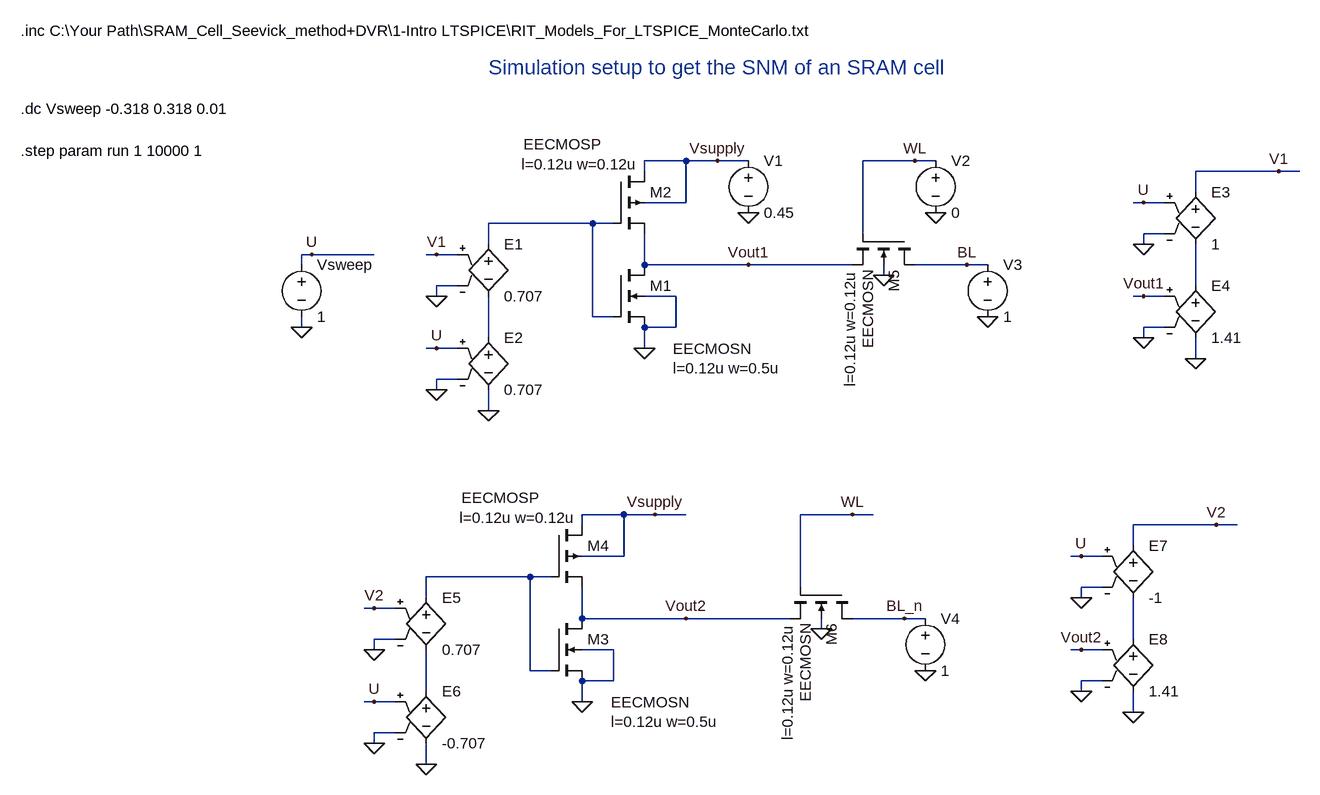
[diagram p0: schematic SNM.asc]
SNM.asc, the LTspice schematic file:
Version 4
SHEET 1 1508 980
WIRE 240 32 176 32
WIRE 288 32 240 32
WIRE 336 32 288 32
WIRE 592 32 512 32
WIRE 624 32 592 32
WIRE 176 48 176 32
WIRE 1152 48 1024 48
WIRE 1184 48 1152 48
WIRE 1024 80 1024 48
WIRE 240 96 240 32
WIRE 240 96 176 96
WIRE 944 96 928 96
WIRE 976 96 944 96
WIRE 96 128 -64 128
WIRE 128 128 96 128
WIRE 512 144 512 32
WIRE 976 144 944 144
WIRE -64 160 -64 128
WIRE 944 160 944 144
WIRE -336 176 -352 176
WIRE -240 176 -336 176
WIRE -144 176 -160 176
WIRE -112 176 -144 176
WIRE -352 192 -352 176
WIRE 176 192 176 144
WIRE 336 192 176 192
WIRE 496 192 336 192
WIRE 672 192 592 192
WIRE 704 192 672 192
WIRE 544 208 544 192
WIRE -112 224 -144 224
WIRE 1024 224 1024 160
WIRE -144 240 -144 224
WIRE 224 240 176 240
WIRE 944 240 928 240
WIRE 976 240 944 240
WIRE 96 272 96 128
WIRE 128 272 96 272
WIRE -352 288 -352 272
WIRE 224 288 224 240
WIRE 224 288 176 288
WIRE 976 288 944 288
WIRE -64 304 -64 240
WIRE 944 304 944 288
WIRE -144 320 -160 320
WIRE -112 320 -144 320
WIRE 176 320 176 288
WIRE 1024 336 1024 304
WIRE -112 368 -144 368
WIRE -144 384 -144 368
WIRE -64 416 -64 384
WIRE 144 576 80 576
WIRE 192 576 144 576
WIRE 240 576 192 576
WIRE 496 576 416 576
WIRE 528 576 496 576
WIRE 80 592 80 576
WIRE 1056 592 928 592
WIRE 1088 592 1056 592
WIRE 928 624 928 592
WIRE 144 640 144 576
WIRE 144 640 80 640
WIRE 848 640 832 640
WIRE 880 640 848 640
WIRE 0 672 -160 672
WIRE 32 672 0 672
WIRE 416 688 416 576
WIRE 880 688 848 688
WIRE -160 704 -160 672
WIRE 848 704 848 688
WIRE -240 720 -256 720
WIRE -208 720 -240 720
WIRE 80 736 80 688
WIRE 240 736 80 736
WIRE 400 736 240 736
WIRE 576 736 496 736
WIRE 608 736 576 736
WIRE 448 752 448 736
WIRE -208 768 -240 768
WIRE 928 768 928 704
WIRE -240 784 -240 768
WIRE 128 784 80 784
WIRE 848 784 832 784
WIRE 880 784 848 784
WIRE 0 816 0 672
WIRE 32 816 0 816
WIRE 128 832 128 784
WIRE 128 832 80 832
WIRE 880 832 848 832
WIRE -160 848 -160 784
WIRE 848 848 848 832
WIRE -240 864 -256 864
WIRE -208 864 -240 864
WIRE 80 864 80 832
WIRE 928 880 928 848
WIRE -208 912 -240 912
WIRE -240 928 -240 912
WIRE -160 960 -160 928
FLAG -352 288 0
FLAG -336 176 U
FLAG -144 240 0
FLAG -144 384 0
FLAG -144 320 U
FLAG -144 176 V1
FLAG -64 416 0
FLAG 176 320 0
FLAG 944 160 0
FLAG 944 304 0
FLAG 1024 336 0
FLAG 944 240 Vout1
FLAG 944 96 U
FLAG 336 192 Vout1
FLAG 1152 48 V1
FLAG -240 784 0
FLAG -240 928 0
FLAG -240 864 U
FLAG -240 720 V2
FLAG -160 960 0
FLAG 80 864 0
FLAG 848 704 0
FLAG 848 848 0
FLAG 928 880 0
FLAG 848 784 Vout2
FLAG 848 640 U
FLAG 240 736 Vout2
FLAG 1056 592 V2
FLAG 544 208 0
FLAG 592 32 WL
FLAG 672 192 BL
FLAG 448 752 0
FLAG 496 576 WL
FLAG 576 736 BL_n
FLAG 336 112 0
FLAG 624 112 0
FLAG 704 272 0
FLAG 608 816 0
FLAG 288 32 Vsupply
FLAG 192 576 Vsupply
SYMBOL voltage -352 176 R0
SYMATTR InstName Vsweep
SYMATTR Value 1
SYMBOL e -64 144 R0
SYMATTR InstName E1
SYMATTR Value 0.707
SYMBOL e -64 288 R0
SYMATTR InstName E2
SYMATTR Value 0.707
SYMBOL nmos4 128 192 R0
WINDOW 3 92 129 Left 2
WINDOW 123 92 159 Left 2
SYMATTR Value EECMOSN
SYMATTR Value2 l=0.12u w=0.5u
SYMATTR InstName M1
SYMBOL pmos4 128 48 R0
WINDOW 3 -138 -42 Left 2
WINDOW 123 -141 -11 Left 2
SYMATTR Value EECMOSP
SYMATTR Value2 l=0.12u w=0.12u
SYMATTR InstName M2
SYMBOL e 1024 64 R0
SYMATTR InstName E3
SYMATTR Value 1
SYMBOL e 1024 208 R0
SYMATTR InstName E4
SYMATTR Value 1.41
SYMBOL e -160 688 R0
SYMATTR InstName E5
SYMATTR Value 0.707
SYMBOL e -160 832 R0
SYMATTR InstName E6
SYMATTR Value -0.707
SYMBOL nmos4 32 736 R0
WINDOW 3 92 129 Left 2
WINDOW 123 92 159 Left 2
SYMATTR Value EECMOSN
SYMATTR Value2 l=0.12u w=0.5u
SYMATTR InstName M3
SYMBOL pmos4 32 592 R0
WINDOW 3 -138 -42 Left 2
WINDOW 123 -141 -11 Left 2
SYMATTR Value EECMOSP
SYMATTR Value2 l=0.12u w=0.12u
SYMATTR InstName M4
SYMBOL e 928 608 R0
SYMATTR InstName E7
SYMATTR Value -1
SYMBOL e 928 752 R0
SYMATTR InstName E8
SYMATTR Value 1.41
SYMBOL nmos4 592 144 R90
WINDOW 123 56 100 Left 2
SYMATTR Value2 l=0.12u w=0.12u
SYMATTR InstName M5
SYMATTR Value EECMOSN
SYMBOL nmos4 496 688 R90
WINDOW 123 56 100 Left 2
SYMATTR Value2 l=0.12u w=0.12u
SYMATTR InstName M6
SYMATTR Value EECMOSN
SYMBOL voltage 336 16 R0
WINDOW 123 0 0 Left 0
WINDOW 39 0 0 Left 0
SYMATTR InstName V1
SYMATTR Value 0.45
SYMBOL voltage 624 16 R0
WINDOW 123 0 0 Left 0
WINDOW 39 0 0 Left 0
SYMATTR InstName V2
SYMATTR Value 0
SYMBOL voltage 704 176 R0
SYMATTR InstName V3
SYMATTR Value 1
SYMBOL voltage 608 720 R0
SYMATTR InstName V4
SYMATTR Value 1
TEXT -784 -168 Left 2 !.inc C:\\Your Path\\SRAM_Cell_Seevick_method+DVR\\1-Intro LTSPICE\\RIT_Models_For_LTSPICE_MonteCarlo.txt
TEXT -784 -48 Left 2 !.dc Vsweep -0.318 0.318 0.01
TEXT -64 -112 Left 3 ;Simulation setup to get the SNM of an SRAM cell
TEXT -784 16 Left 2 !.step param run 1 10000 1

The netlist it stands for:
* SNM.asc
Vsweep U 0 1
E1 N001 N003 V1 0 0.707
E2 N003 0 U 0 0.707
M1 Vout1 N001 0 0 EECMOSN l=0.12u w=0.5u
M2 Vsupply N001 Vout1 Vsupply EECMOSP l=0.12u w=0.12u
E3 V1 N002 U 0 1
E4 N002 0 Vout1 0 1.41
E5 N004 N006 V2 0 0.707
E6 N006 0 U 0 -0.707
M3 Vout2 N004 0 0 EECMOSN l=0.12u w=0.5u
M4 Vsupply N004 Vout2 Vsupply EECMOSP l=0.12u w=0.12u
E7 V2 N005 U 0 -1
E8 N005 0 Vout2 0 1.41
M5 BL WL Vout1 0 EECMOSN l=0.12u w=0.12u
M6 BL_n WL Vout2 0 EECMOSN l=0.12u w=0.12u
V1 Vsupply 0 0.45
V2 WL 0 0
V3 BL 0 1
V4 BL_n 0 1
.model NMOS NMOS
.model PMOS PMOS
.lib standard.mos
.inc C:\Your Path\SRAM_Cell_Seevick_method+DVR\1-Intro LTSPICE\RIT_Models_For_LTSPICE_MonteCarlo.txt
.dc Vsweep -0.318 0.318 0.01
* Simulation setup to get the SNM of an SRAM cell
.step param run 1 10000 1
.backanno
.end